# EAGLE design fm (EAGLE 9.5.2)
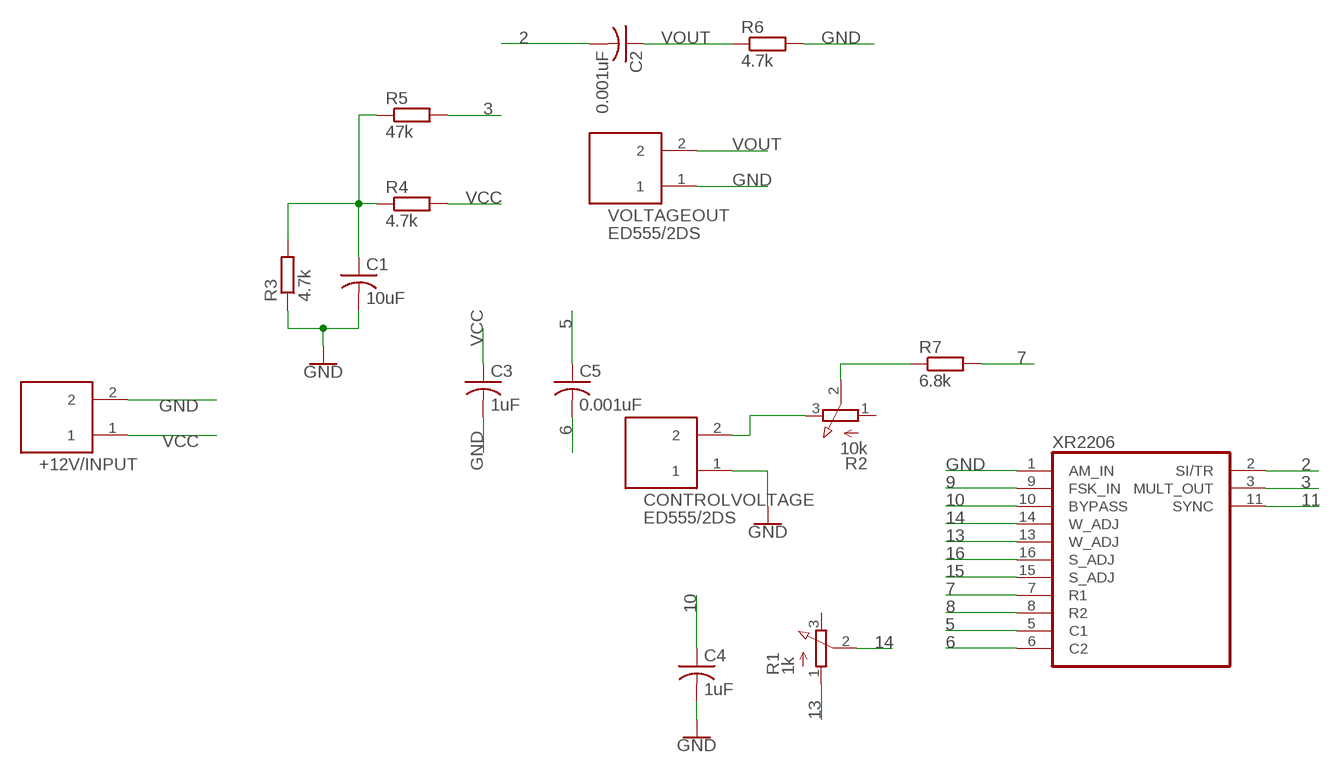
[diagram p0: schematic, sheet 1]

## Parts
+12V/INPUT  ED555/2DS  [ED555/2DS]
C1  10uF  C-US050-030X075  [C050-030X075]
C2  0.001uF  C-US050-030X075  [C050-030X075]
C3  1uF  C-US050-030X075  [C050-030X075]
C4  1uF  C-US050-030X075  [C050-030X075]
C5  0.001uF  C-US050-030X075  [C050-030X075]
CONTROLVOLTAGE  ED555/2DS  [ED555/2DS]
R1  1k  3RP/1610N  [3RP/1610N]
R2  10k  3RP/1610N  [3RP/1610N]
R3  4.7k  R-EU_0207/10  [0207/10]
R4  4.7k  R-EU_0207/10  [0207/10]
R5  47k  R-EU_0207/10  [0207/10]
R6  4.7k  R-EU_0207/10  [0207/10]
R7  6.8k  R-EU_0207/10  [0207/10]
VOLTAGEOUT  ED555/2DS  [ED555/2DS]
XR2206  XR-2206  [DIL16]

## Nets
2: C2.2 XR2206.2(SI/TR)
3: R5.2 XR2206.3(MULT_OUT)
5: C5.1 XR2206.5(C1)
6: C5.2 XR2206.6(C2)
7: R7.2 XR2206.7(R1)
8: XR2206.8(R2)
9: XR2206.9(FSK_IN)
10: C4.1 XR2206.10(BYPASS)
11: XR2206.11(SYNC)
13: R1.1(A) XR2206.13(W_ADJ)
14: R1.2(S) XR2206.14(W_ADJ)
15: XR2206.15(S_ADJ)
16: XR2206.16(S_ADJ)
GND: +12V/INPUT.2 C1.2 C3.2 C4.2 CONTROLVOLTAGE.1 R3.1 R6.2 VOLTAGEOUT.1 XR2206.1(AM_IN)
N$1: C1.1 R3.2 R4.1 R5.1
N$2: R2.2(S) R7.1
N$3: CONTROLVOLTAGE.2 R2.3(E)
VCC: +12V/INPUT.1 C3.1 R4.2
VOUT: C2.1 R6.1 VOLTAGEOUT.2
Unconnected: R1.3(E) R2.1(A)

## Power pins joined to a net without a drawn wire
GND: XR2206.12(GND)
VCC: XR2206.4(VCC)

## Library data of the parts
+12V/INPUT CONTROLVOLTAGE VOLTAGEOUT = DC_LOAD_AU:ED555/2DS: 2-Pin Terminal Block 3.5mm pitch 6A
C1-C5 = adafruit:C-US: CAPACITOR, American symbol
R1 R2 = pot:3RP/1610N: 16mm Potentiometer one level Source: http://www.alphapotentiometers.net/html/16mm_pot_2.html
R3-R7 = rcl:R-EU_: RESISTOR, European symbol; SPICEPREFIX: R
XR2206 = exar:XR-2206: Monolithic FUNCTION GENERATOR; OC_FARNELL: unknown; OC_NEWARK: unknown

## Net classes
0 default: width 0.305 mm, drill 0.508 mm, clearance 0.635 mm

## Board
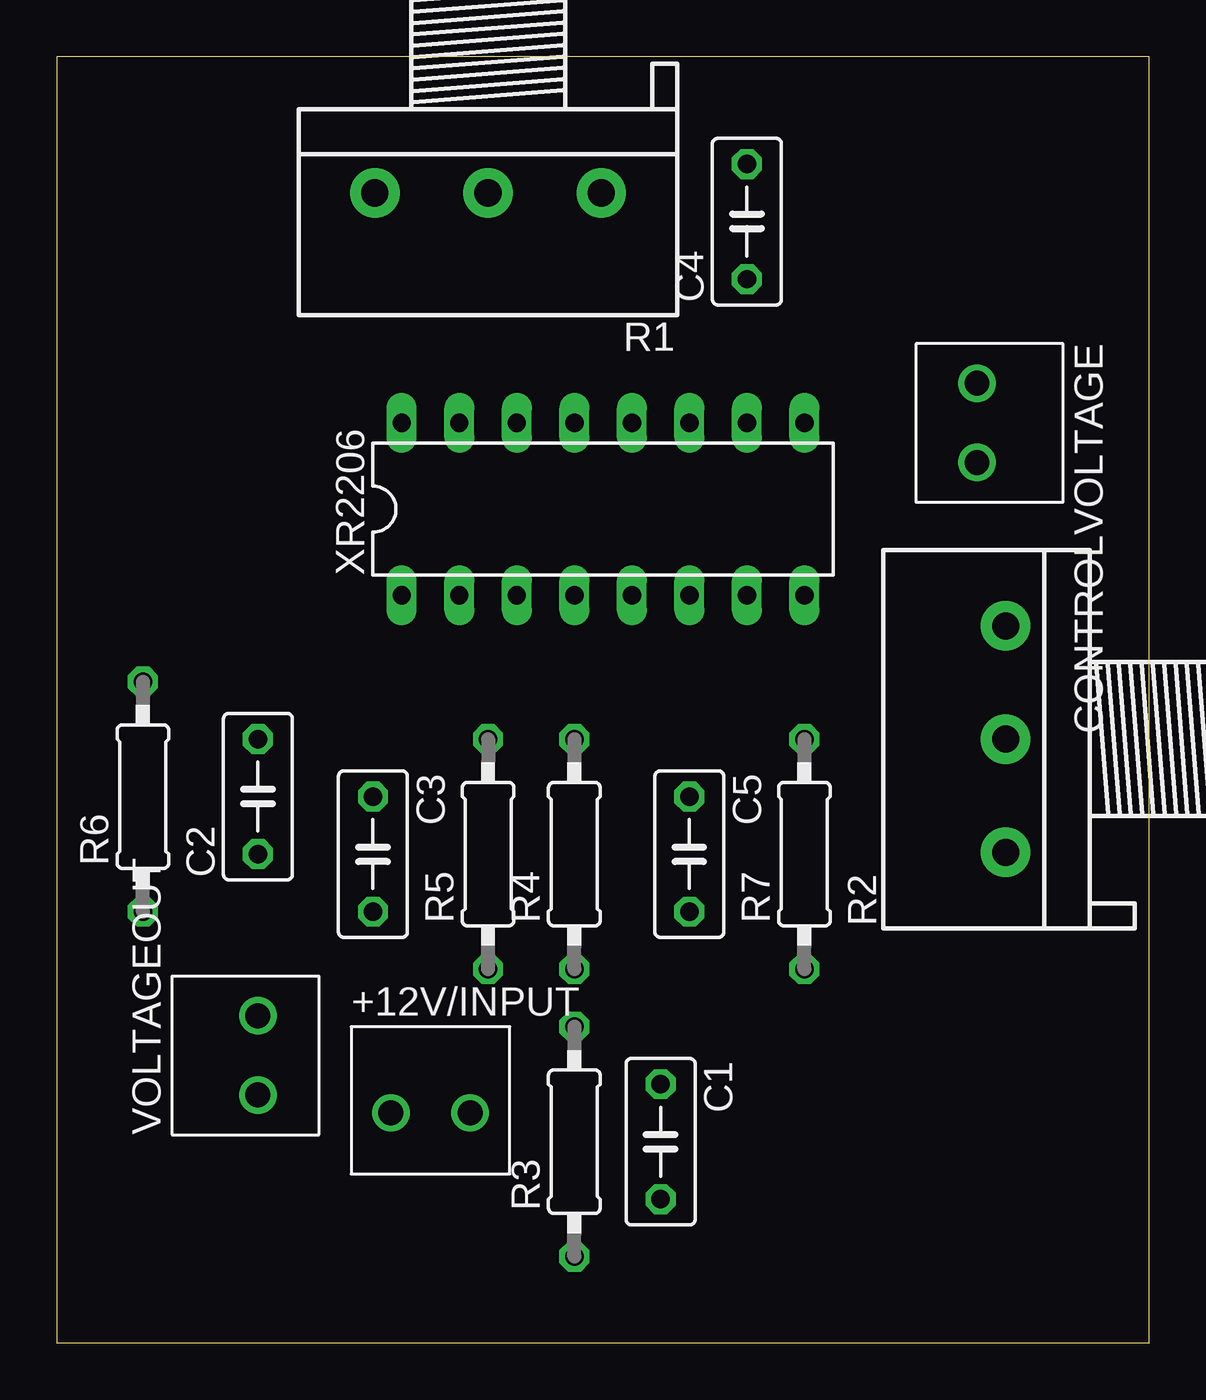
[diagram p1: board, top side]
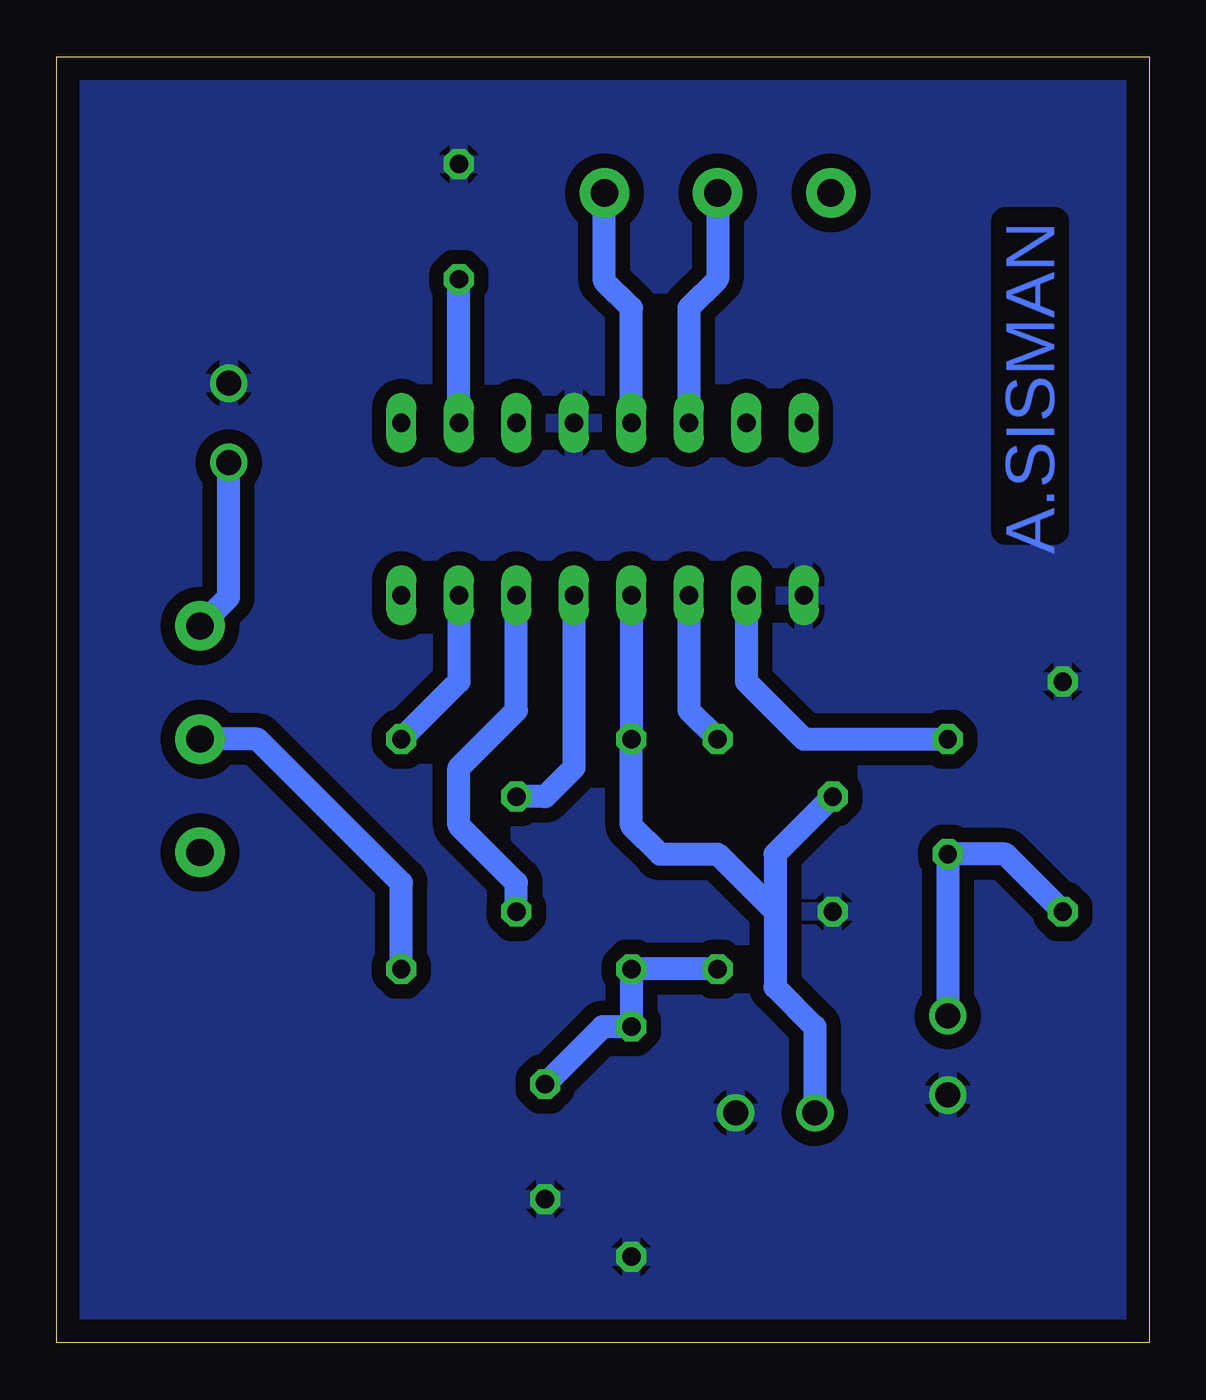
[diagram p2: board, bottom side, seen from below]

Size 48.24 x 56.82 mm. Coordinates in mm from the lower left corner, seen from the top.
Outline: 0,0 48.24,0 48.24,56.82 0,56.82 0,0
Copper layers (1*16): Top 0.035mm / dielectric 1.5mm / Bottom 0.035mm
Design rules "default": minimum track width 6mil, minimum drill 0.35mm, track to track 6mil, track to pad 6mil, pad to pad 6mil, via to via 6mil, smd to smd 6mil, copper to edge 40mil, drill to drill 6mil, minimum pad ring 10mil, minimum via ring 8mil, stop-mask expansion 4mil, vias tented up to drill 0mil, thermal gap 10mil

### Footprints (pad centres in the part's own frame; a part is rotated, then mirrored left to right if it is on the bottom)
ED555/2DS = drill 1.1: 1 -1.75,0; 2 1.75,0
C050-030X075 = drill 0.813 octagon: 1 -2.54,0; 2 2.54,0
3RP/1610N = drill 1.2 pad 2.184: 1 -5,0; 2 0,0; 3 5,0
0207/10 = drill 0.813 octagon: 1 -5.08,0; 2 5.08,0
DIL16 = drill 0.813 long: 1 -8.89,-3.81; 2 -6.35,-3.81; 3 -3.81,-3.81; 4 -1.27,-3.81; 5 1.27,-3.81; 6 3.81,-3.81; 7 6.35,-3.81; 8 8.89,-3.81; 9 8.89,3.81; 10 6.35,3.81; 11 3.81,3.81; 12 1.27,3.81; 13 -1.27,3.81; 14 -3.81,3.81; 15 -6.35,3.81; 16 -8.89,3.81

### Placement (x,y rotation side)
+12V/INPUT  16.51,10.16 0 top
C1  26.67,8.89 270 top
C2  8.89,24.13 90 top
C3  13.97,21.59 270 top
C4  30.48,49.53 90 top
C5  27.94,21.59 270 top
CONTROLVOLTAGE  40.64,40.64 270 top
R1  19.05,50.8 180 top
R2  41.91,26.67 90 top
R3  22.86,8.89 90 top
R4  22.86,21.59 90 top
R5  19.05,21.59 90 top
R6  3.81,24.13 90 top
R7  33.02,21.59 90 top
VOLTAGEOUT  8.89,12.7 90 top
XR2206  24.13,36.83 0 top

### Tracks (layer width: path | path; a pad name or v marks a point on that pad's centre or on a via)
2
  Bottom 1.016: XR2206.2 17.78,29.21 15.24,26.67 C2.2
3
  Bottom 1.016: XR2206.3 20.32,27.94 R5.2
5
  Bottom 1.016: XR2206.5 25.4,25.4 26.67,24.13 C5.1
6
  Bottom 1.016: C5.2 27.94,20.32 30.48,22.86 30.48,25.4 27.94,27.94 XR2206.6
7
  Bottom 1.016: XR2206.7 30.48,29.21 R7.2
10
  Bottom 1.016: XR2206.10 C4.1
13
  Bottom 1.016: XR2206.13 22.86,45.72 24.05,46.91 R1.1
14
  Bottom 1.016: R1.2 19.05,46.99 20.32,45.72 XR2206.14
GND
  pour Bottom: -1.27,58.42 49.53,58.42 49.53,-1.27 -1.27,-1.27
N$1
  Bottom 1.016: R5.1 R4.1 R3.2 24.13,13.97 C1.1
N$2
  Bottom 1.016: R7.1 33.02,20.32 39.37,26.67 R2.2
N$3
  Bottom 1.016: R2.3 40.64,32.94 CONTROLVOLTAGE.2
VCC
  Bottom 1.016: XR2206.4 R4.2 22.86,22.86 21.59,21.59 19.05,21.59 16.51,19.05 | C3.1 16.51,21.59 16.51,19.05 | 16.51,19.05 16.51,15.72 14.76,13.97 +12V/INPUT.1
VOUT
  Bottom 1.016: R6.1 6.35,21.59 C2.1 VOLTAGEOUT.2

### Text on the board
Bottom: A.SISMAN